# Altium schematic sheet IMSAI_SIO_Emulation.SchDoc: IMSAI SIO Emulation
size Tabloid; ApprovedBy: 1; CheckedBy: 1; Author: Codetector; CompanyName: Codetector; Engineer: 1; Organization: IMSAI Gang; Revision: 1; SheetNumber: 1; SheetTotal: 1; Application_BuildNumber: 1
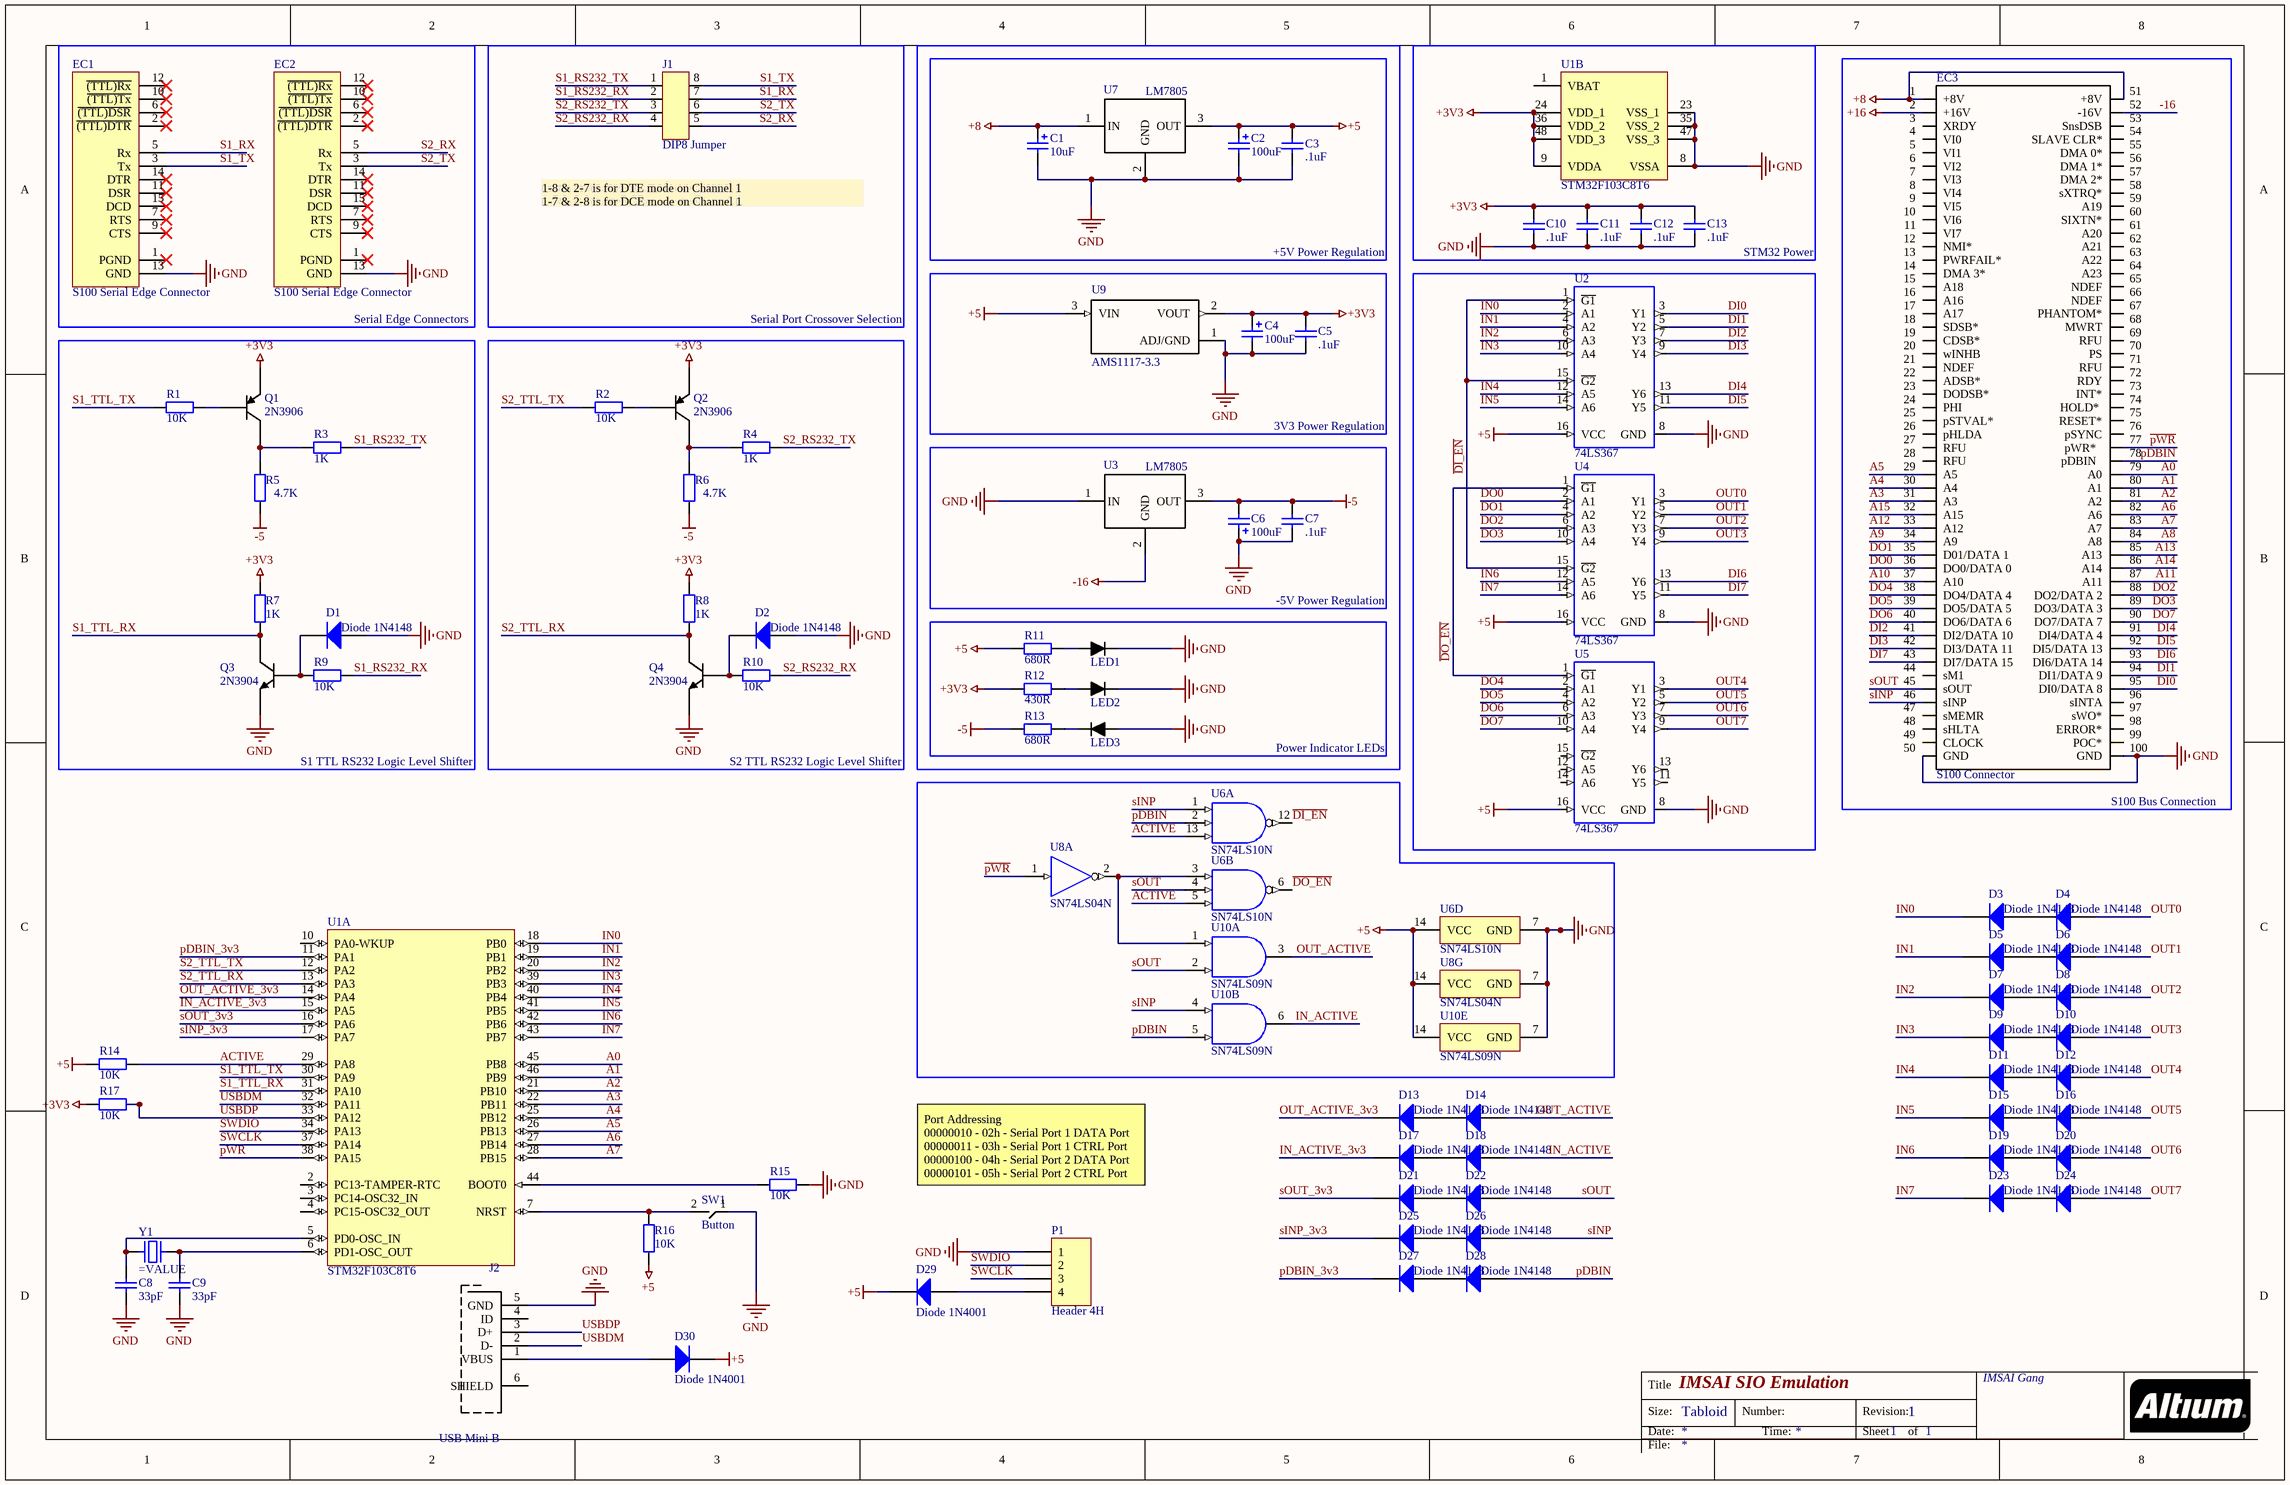
[diagram p0: IMSAI_SIO_Emulation.SchDoc]

## Parts
C1  value 10uF  [Cap THT 2.5-5-11]  (hidden comment: Capacitor 10uF)
C2  value 100uF  [CAP THT 2.5-6.5-12]  (hidden comment: Capacitor 100uF)
C3  value .1uF  [CAP THT 2.5x5x5]  (hidden comment: Capacitor .1uF)
C4  value 100uF  [CAP THT 2.5-6.5-12]  (hidden comment: Capacitor 100uF)
C5  value .1uF  [CAP THT 2.5x5x5]  (hidden comment: Capacitor .1uF)
C6  value 100uF  [CAP THT 2.5-6.5-12]  (hidden comment: Capacitor 100uF)
C7  value .1uF  [CAP THT 2.5x5x5]  (hidden comment: Capacitor .1uF)
C8  value 33pF  [Cap THT 2.5-2-4 Ceramic]  (hidden comment: Capacitor 33pF)
C9  value 33pF  [Cap THT 2.5-2-4 Ceramic]  (hidden comment: Capacitor 33pF)
C10  value .1uF  [CAP THT 2.5x5x5]  (hidden comment: Capacitor .1uF)
C11  value .1uF  [CAP THT 2.5x5x5]  (hidden comment: Capacitor .1uF)
C12  value .1uF  [CAP THT 2.5x5x5]  (hidden comment: Capacitor .1uF)
C13  value .1uF  [CAP THT 2.5x5x5]  (hidden comment: Capacitor .1uF)
D1  Diode 1N4148  [DO-35]
D2  Diode 1N4148  [DO-35]
D3  Diode 1N4148  [DO-35]
D4  Diode 1N4148  [DO-35]
D5  Diode 1N4148  [DO-35]
D6  Diode 1N4148  [DO-35]
D7  Diode 1N4148  [DO-35]
D8  Diode 1N4148  [DO-35]
D9  Diode 1N4148  [DO-35]
D10  Diode 1N4148  [DO-35]
D11  Diode 1N4148  [DO-35]
D12  Diode 1N4148  [DO-35]
D13  Diode 1N4148  [DO-35]
D14  Diode 1N4148  [DO-35]
D15  Diode 1N4148  [DO-35]
D16  Diode 1N4148  [DO-35]
D17  Diode 1N4148  [DO-35]
D18  Diode 1N4148  [DO-35]
D19  Diode 1N4148  [DO-35]
D20  Diode 1N4148  [DO-35]
D21  Diode 1N4148  [DO-35]
D22  Diode 1N4148  [DO-35]
D23  Diode 1N4148  [DO-35]
D24  Diode 1N4148  [DO-35]
D25  Diode 1N4148  [DO-35]
D26  Diode 1N4148  [DO-35]
D27  Diode 1N4148  [DO-35]
D28  Diode 1N4148  [DO-35]
D29  Diode 1N4001  [DO-41]
D30  Diode 1N4001  [DO-41]
EC1  S100 Serial Edge Connector  [E26 Edge Connector]
EC2  S100 Serial Edge Connector  [E26 Edge Connector]
EC3  S100 Connector  [S100]
J1  DIP8 Jumper  [DIP8]
J2  USB Mini B  [USB Mini B]
LED1  Generic LED 5mm  [LED 5mm THT]  (value not drawn)
LED2  Generic LED 5mm  [LED 5mm THT]  (value not drawn)
LED3  Generic LED 5mm  [LED 5mm THT]  (value not drawn)
P1  Header 4H  [HDR1X4H]
Q1  2N3906  [TO-92A]
Q2  2N3906  [TO-92A]
Q3  2N3904  [TO-92A]
Q4  2N3904  [TO-92A]
R1  Res2  [AXIAL-0.4]  (value not drawn)
R2  Res2  [AXIAL-0.4]  (value not drawn)
R3  Res2  [AXIAL-0.4]  (value not drawn)
R4  Res2  [AXIAL-0.4]  (value not drawn)
R5  Res2  [AXIAL-0.4]  (value not drawn)
R6  Res2  [AXIAL-0.4]  (value not drawn)
R7  Res2  [AXIAL-0.4]  (value not drawn)
R8  Res2  [AXIAL-0.4]  (value not drawn)
R9  Res2  [AXIAL-0.4]  (value not drawn)
R10  Res2  [AXIAL-0.4]  (value not drawn)
R11  Res2  [AXIAL-0.4]  (value not drawn)
R12  Res2  [AXIAL-0.4]  (value not drawn)
R13  Res2  [AXIAL-0.4]  (value not drawn)
R14  Res2  [AXIAL-0.4]  (value not drawn)
R15  Res2  [AXIAL-0.4]  (value not drawn)
R16  Res2  [AXIAL-0.4]  (value not drawn)
R17  Res2  [AXIAL-0.4]  (value not drawn)
SW1  Button  [SMD_PUSHBUTTON_LCSC]
U1  STM32F103C8T6  [STM-LQFP48_L]  (parts A,B of 2)
U2  74LS367  [DIP16]
U3  LM7805  [TO220]
U4  74LS367  [DIP16]
U5  74LS367  [DIP16]
U6  SN74LS10N  [N0014A]  (parts A,B,D of 4)
U7  LM7805  [TO220]
U8  SN74LS04N  [N0014A]  (parts A,G of 7)
U9  AMS1117-3.3  [TO220]
U10  SN74LS09N  [N0014A]  (parts A,B,E of 5)
Y1  (no value)  [ABRACON ABLS]

## Blocks framed on the sheet
Serial Edge Connectors: EC1 EC2
Power Indicator LEDs: C1-C3 U7
S100 Bus Connection: EC3
+5V Power Regulation: C4 C5 U9
STM32 Power: U2 U4 U5
S1 TTL RS232 Logic Level Shifter: D1 Q1 Q3 R1 R3 R5 R7 R9
3V3 Power Regulation: C6 C7 U3
-5V Power Regulation: LED1-LED3 R11-R13

## Nets
+3V3: C4.1 C5.2 C10.2 C11.2 C12.2 C13.2 Q1.1(E) Q2.1(E) R7.1 R8.1 R12.2 R17.2 U1.9(VDDA) U1.24(VDD_1) U1.36(VDD_2) U1.48(VDD_3) U9.2(VOUT)
+5: C2.1 C3.2 D29.2(K) D30.2(K) R11.2 R14.2 R16.2 U2.16(VCC) U4.16(VCC) U5.16(VCC) U6.14(VCC) U7.3(OUT) U8.14(VCC) U9.3(VIN) U10.14(VCC)
+8: C1.1 EC3.1(+8V) EC3.51(+8V) U7.1(IN)
+16: EC3.2(+16V)
-5: C6.2 C7.1 R5.1 R6.1 R13.2 U3.3(OUT)
-16: EC3.52(-16V) U3.2(GND)
GND: C1.2 C2.2 C3.1 C4.2 C5.1 C6.1 C7.2 C8.1 C9.1 C10.1 C11.1 C12.1 C13.1 D1.1(A) D2.1(A) EC1.13(GND) EC2.13(GND) EC3.50(GND) EC3.100(GND) J2.5(GND) LED1.2(K) LED2.2(K) LED3.1(A) P1.1 Q3.1(E) Q4.1(E) R15.1 SW1.1 U1.8(VSSA) U1.23(VSS_1) U1.35(VSS_2) U1.47(VSS_3) U2.8(GND) U3.1(IN) U4.8(GND) U5.8(GND) U6.7(GND) U7.2(GND) U8.7(GND) U9.1(ADJ/GND) U10.7(GND)
~{DI_EN}: U2.1(~{G1}) U2.15(~{G2}) U4.15(~{G2}) U6.12(1Y)
~{DO_EN}: U4.1(~{G1}) U5.1(~{G1}) U6.6(2Y)
~{pWR}: EC3.77(pWR*) U1.38(PA15) U8.1(1A)
A0: EC3.79(A0) U1.45(PB8)
A1: EC3.80(A1) U1.46(PB9)
A2: EC3.81(A2) U1.21(PB10)
A3: EC3.31(A3) U1.22(PB11)
A4: EC3.30(A4) U1.25(PB12)
A5: EC3.29(A5) U1.26(PB13)
A6: EC3.82(A6) U1.27(PB14)
A7: EC3.83(A7) U1.28(PB15)
A8: EC3.84(A8)
A9: EC3.34(A9)
A10: EC3.37(A10)
A11: EC3.87(A11)
A12: EC3.33(A12)
A13: EC3.85(A13)
A14: EC3.86(A14)
A15: EC3.32(A15)
ACTIVE: R14.1 U1.29(PA8) U6.5(2C) U6.13(1C)
DI0: EC3.95(DI0/DATA_8) U2.3(Y1)
DI1: EC3.94(DI1/DATA_9) U2.5(Y2)
DI2: EC3.41(DI2/DATA_10) U2.7(Y3)
DI3: EC3.42(DI3/DATA_11) U2.9(Y4)
DI4: EC3.91(DI4/DATA_4) U2.13(Y6)
DI5: EC3.92(DI5/DATA_13) U2.11(Y5)
DI6: EC3.93(DI6/DATA_14) U4.13(Y6)
DI7: EC3.43(DI7/DATA_15) U4.11(Y5)
DO0: EC3.36(DO0/DATA_0) U4.2(A1)
DO1: EC3.35(D01/DATA_1) U4.4(A2)
DO2: EC3.88(DO2/DATA_2) U4.6(A3)
DO3: EC3.89(DO3/DATA_3) U4.10(A4)
DO4: EC3.38(DO4/DATA_4) U5.2(A1)
DO5: EC3.39(DO5/DATA_5) U5.4(A2)
DO6: EC3.40(DO6/DATA_6) U5.6(A3)
DO7: EC3.90(DO7/DATA_7) U5.10(A4)
IN0: D3.2(K) U1.18(PB0) U2.2(A1)
IN1: D5.2(K) U1.19(PB1) U2.4(A2)
IN2: D7.2(K) U1.20(PB2) U2.6(A3)
IN3: D9.2(K) U1.39(PB3) U2.10(A4)
IN4: D11.2(K) U1.40(PB4) U2.12(A5)
IN5: D15.2(K) U1.41(PB5) U2.14(A6)
IN6: D19.2(K) U1.42(PB6) U4.12(A5)
IN7: D23.2(K) U1.43(PB7) U4.14(A6)
IN_ACTIVE: D18.1(A) U10.6(2Y)
IN_ACTIVE_3v3: D17.2(K) U1.15(PA5)
OUT0: D4.1(A) U4.3(Y1)
OUT1: D6.1(A) U4.5(Y2)
OUT2: D8.1(A) U4.7(Y3)
OUT3: D10.1(A) U4.9(Y4)
OUT4: D12.1(A) U5.3(Y1)
OUT5: D16.1(A) U5.5(Y2)
OUT6: D20.1(A) U5.7(Y3)
OUT7: D24.1(A) U5.9(Y4)
OUT_ACTIVE: D14.1(A) U10.3(1Y)
OUT_ACTIVE_3v3: D13.2(K) U1.14(PA4)
pDBIN: D28.1(A) EC3.78(pDBIN) U6.2(1B) U10.5(2B)
pDBIN_3v3: D27.2(K) U1.11(PA1)
S1_RS232_RX: J1.2 R9.1
S1_RS232_TX: J1.1 R3.1
S1_RX: EC1.5(Rx) J1.7
S1_TTL_RX: Q3.3(C) R7.2 U1.31(PA10)
S1_TTL_TX: R1.2 U1.30(PA9)
S1_TX: EC1.3(Tx) J1.8
S2_RS232_RX: J1.4 R10.1
S2_RS232_TX: J1.3 R4.1
S2_RX: EC2.5(Rx) J1.5
S2_TTL_RX: Q4.3(C) R8.2 U1.13(PA3)
S2_TTL_TX: R2.2 U1.12(PA2)
S2_TX: EC2.3(Tx) J1.6
sINP: D26.1(A) EC3.46(sINP) U6.1(1A) U10.4(2A)
sINP_3v3: D25.2(K) U1.17(PA7)
sOUT: D22.1(A) EC3.45(sOUT) U6.4(2B) U10.2(1B)
sOUT_3v3: D21.2(K) U1.16(PA6)
SWCLK: P1.3 U1.37(PA14)
SWDIO: P1.2 U1.34(PA13)
USBDM: J2.2(D-) U1.32(PA11)
USBDP: J2.3(D+) R17.1 U1.33(PA12)
NetC8_2: C8.2 U1.5(PD0-OSC_IN) Y1.2
NetC9_2: C9.2 U1.6(PD1-OSC_OUT) Y1.1
NetD1_2: D1.2(K) Q3.2(B) R9.2
NetD2_2: D2.2(K) Q4.2(B) R10.2
NetD3_1: D3.1(A) D4.2(K)
NetD5_1: D5.1(A) D6.2(K)
NetD7_1: D7.1(A) D8.2(K)
NetD9_1: D9.1(A) D10.2(K)
NetD11_1: D11.1(A) D12.2(K)
NetD13_1: D13.1(A) D14.2(K)
NetD15_1: D15.1(A) D16.2(K)
NetD17_1: D17.1(A) D18.2(K)
NetD19_1: D19.1(A) D20.2(K)
NetD21_1: D21.1(A) D22.2(K)
NetD23_1: D23.1(A) D24.2(K)
NetD25_1: D25.1(A) D26.2(K)
NetD27_1: D27.1(A) D28.2(K)
NetD29_1: D29.1(A) P1.4
NetD30_1: D30.1(A) J2.1(VBUS)
NetLED1_1: LED1.1(A) R11.1
NetLED2_1: LED2.1(A) R12.1
NetLED3_2: LED3.2(K) R13.1
NetQ1_2: Q1.2(B) R1.1
NetQ1_3: Q1.3(C) R3.2 R5.2
NetQ2_2: Q2.2(B) R2.1
NetQ2_3: Q2.3(C) R4.2 R6.2
NetR15_2: R15.2 U1.44(BOOT0)
NetR16_1: R16.1 SW1.2 U1.7(NRST)
NetU6_3: U6.3(2A) U8.2(~{1Y}) U10.1(1A)

Not connected (* = marked no-connect by the designer): EC1 1(PGND)* 2(~{(TTL)DTR})* 6(~{(TTL)DSR})* 7(RTS)* 9(CTS)* 10(~{(TTL)Tx})* 11(DSR)* 12(~{(TTL)Rx})* 14(DTR)* 15(DCD)*; EC2 1(PGND)* 2(~{(TTL)DTR})* 6(~{(TTL)DSR})* 7(RTS)* 9(CTS)* 10(~{(TTL)Tx})* 11(DSR)* 12(~{(TTL)Rx})* 14(DTR)* 15(DCD)*; EC3 3(XRDY) 4(VI0) 5(VI1) 6(VI2) 7(VI3) 8(VI4) 9(VI5) 10(VI6) 11(VI7) 12(NMI*) 13(PWRFAIL*) 14(DMA_3*) 15(A18 ) 16(A16  ) 17(A17) 18(SDSB*) 19(CDSB*) 20(wINHB) 21(NDEF) 22(ADSB*) 23(DODSB*) 24(PHI) 25(pSTVAL*) 26(pHLDA) 27(RFU) 28(RFU) 44(sM1) 47(sMEMR) 48(sHLTA) 49(CLOCK ) 53(SnsDSB) 54(SLAVE_CLR*) 55(DMA_0*) 56(DMA_1*) 57(DMA_2*) 58(sXTRQ*) 59(A19) 60(SIXTN*) 61(A20) 62(A21) 63(A22) 64(A23) 65(NDEF) 66(NDEF) 67(PHANTOM*) 68(MWRT) 69(RFU) 70(PS) 71(RFU) 72(RDY) 73(INT*) 74(HOLD* ) 75(RESET*) 76(pSYNC) 96(sINTA) 97(sWO*) 98(ERROR*) 99(POC*); J2 4(ID) 6(SHIELD); U1 1(VBAT) 2(PC13-TAMPER-RTC) 3(PC14-OSC32_IN) 4(PC15-OSC32_OUT) 10(PA0-WKUP); U5 11(Y5) 12(A5) 13(Y6) 14(A6) 15(~{G2})

## Notes on the sheet
- 1-8 & 2-7 is for DTE mode on Channel 1
  1-7 & 2-8 is for DCE mode on Channel 1
- Serial Port Crossover Selection
- S2 TTL RS232 Logic Level Shifter
- Port Addressing
  00000010 - 02h - Serial Port 1 DATA Port
  00000011 - 03h - Serial Port 1 CTRL Port
  00000100 - 04h - Serial Port 2 DATA Port
  00000101 - 05h - Serial Port 2 CTRL Port
- Title
- Size:
- Date:
- Tabloid
- Number:
- Time:
- Revision:
- Sheet
- of
- File:
- (in symbol Res2) 4.7K; 10K; 1K; 680R; 430R

## Library data of the parts
D1-D28 = Diode 1N4148: High Conductance Fast Diode; Published: 8-Jun-2000; LatestRevisionDate: 17-Jul-2002; LatestRevisionNote: Re-released for DXP Platform.; DatasheetVersion: 1997; PackageReference: DO-35; Publisher: Altium Limited; PackageDescription: Diode, Axial; Body 3.8 x 1.9 mm (LxDia. max), Lead Dia. 0.53 mm (max); Code_JEDEC: DO-204-AH; ComponentLink1Description: Manufacturer Link; ComponentLink1URL: http://www.fairchildsemi.com/; ComponentLink2Description: Datasheet; ComponentLink2URL: http://www.fairchildsemi.com/ds/1N%2F1N4148.pdf
D29 D30 = Diode 1N4001: 1 Amp General Purpose Rectifier; Published: 8-Jun-2000; LatestRevisionDate: 17-Jul-2002; LatestRevisionNote: Re-released for DXP Platform.; DatasheetVersion: 1998; PackageVersion: Aug-1999; PackageReference: DO-41; Publisher: Altium Limited; PackageDescription: Diode, Axial; Body 5.2 x 2.7 mm (LxDia. max), Lead Dia. 0.86 mm (max); Code_JEDEC: DO-204-AL; ComponentLink1Description: Manufacturer Link; ComponentLink1URL: http://www.fairchildsemi.com/; ComponentLink2Description: Datasheet; ComponentLink2URL: http://www.fairchildsemi.com/ds/1N%2F1N4001.pdf
J2 = USB Mini B: MINI USB A - 5POS Horizontal through hole; MF: Wurth Electronics; MP: 651005136521; Package: None; Price: 1.78 USD; Availability: Good; SnapEDA_Link: https://www.snapeda.com/symbols-footprints/651005136521/Wurth%20Electronics%20Inc/view-part/?ref=snap; Value: *
P1 = Header 4H: Header, 4-Pin, Right Angle; LatestRevisionDate: 17-Jul-2002; LatestRevisionNote: Re-released for DXP Platform.; Publisher: Altium Limited
Q1 Q2 = 2N3906: 2N3906 GP PNP; Published: 8-Jun-2000; LatestRevisionDate: 15-Jan-2003; LatestRevisionNote: PCB Footprint 'BCY-W3/D4.7' replaced; DatasheetVersion: 1997; PackageVersion: Sep-1998; PackageReference: TO-92A; Publisher: Altium Limited; PackageDescription: TO, Flat Index; 3 In-Line, Axial Leads; Body Dia. 4.5mm; Leads 0.51 x 0.48 mm (max); ComponentLink1Description: Manufacturer Link; ComponentLink1URL: http://www.fairchildsemi.com/; ComponentLink2Description: Datasheet; ComponentLink2URL: http://www.fairchildsemi.com/ds/2N%2F2N3906.pdf
Q3 Q4 = 2N3904: NPN General Purpose Amplifier; Published: 8-Jun-2000; LatestRevisionDate: 15-Jan-2003; LatestRevisionNote: PCB Footprint 'BCY-W3/D4.7' replaced; DatasheetVersion: 1997; PackageVersion: Sep-1998; PackageReference: TO-92A; Publisher: Altium Limited; PackageDescription: TO, Flat Index; 3 In-Line, Axial Leads; Body Dia. 4.5mm; Leads 0.51 x 0.48 mm (max); ComponentLink1Description: Manufacturer Link; ComponentLink1URL: http://www.fairchildsemi.com/; ComponentLink2Description: Datasheet; ComponentLink2URL: http://www.fairchildsemi.com/ds/2N%2F2N3904.pdf
R1-R17 = Res2: Resistor; Published: 8-Jun-2000; LatestRevisionDate: 17-Jul-2002; LatestRevisionNote: Re-released for DXP Platform.; PackageReference: AXIAL-0.4; Publisher: Altium Limited; PackageDescription: Axial Device, Thru-Hole; 2 Leads; 0.4 in Pin Spacing
SW1 = Button: LCSC Push button SMD
U1 = STM32F103C8T6: ARM Cortex-M3 32-bit MCU, 64 KB Flash, 20 KB Internal RAM, 37 I/Os, 48-pin LQFP, -40 to 85 degC, Tray; A/D Converter: 2x12-bit (10 Channel); FLASH Size (Prog) (kB): 64; I/Os (High Current): 37; Internal RAM Size (kB): 20; Operating Frequency(F) (Processor speed) (MHz): 72; Supply Voltage(Vcc) min (V): 2; DatasheetVersion: Rev. 16; PackageVersion: Rev. 6, 06/2013; PackageReference: LQFP48; PackageDescription: 48-Pin Low Profile Quad Flat Package, 7 x 7 mm Body, 0.5 mm Pitch; Supplier 1: Digi-Key; Supplier Part Number 1: 497-6063-ND; Supplier 2: Farnell; Supplier Part Number 2: 1447637; Supplier 3: Newark; Supplier Part Number 3: 59M2182; Supplier 4: Newark; Supplier Part Number 4: 57P1222; Supplier 5: Mouser; Supplier Part Number 5: 511-STM32F103C8T6; Core: ARM Cortex-M3; Packing: Tray; Mounting Technology: Surface Mount; PartNumber: STM32F103C8T6; ComponentLink1Description: Manufacturer URL; ComponentLink1URL: http://www.st.com/web/en/home.html; ComponentLink2Description: Datasheet; ComponentLink2URL: http://www.st.com/st-web-ui/static/active/en/resource/technical/document/datasheet/CD00161566.pdf; ComponentLink3Description: Package Specification; ComponentLink3URL: http://www.st.com/st-web-ui/static/active/en/resource/technical/document/datasheet/DM00058181.pdf
U3 U7 = LM7805: LM7805 Linear Voltage Regulator
U6 = SN74LS10N: Triple 3-input positive-NAND gates, N0014A, TUBE; Manufacturer: Texas Instruments; VCC(Min)(V): 4.75; VCC(Max)(V): 5.25; Output Type: TTL; ICC @ Nom Voltage(Max)(mA): 0.027; Bits(#): 3; F @ Nom Voltage(Max)(Mhz): 35; Rating: Catalog; Technology Family: LS; Voltage(Nom)(V): 5; Schmitt Trigger: No; Output Drive (IOL/IOH)(Max)(mA): 1/-20; DatasheetVersion: SDLS035A; PackageReference: N0014A; Supplier 1: Mouser; Supplier Part Number 1: 595-SN74LS10N; Supplier 2: Digi-Key; Supplier Part Number 2: 296-1634-5-ND; Generic Part Number: SN74LS10; Input Type: TTL; Operating Temperature Range(C): 0 to 70; tpd @ Nom Voltage(Max)(ns): 5; Code_JEDEC: MS-001; PartNumber: SN74LS10N; ComponentLink1Description: Manufacturer URL; ComponentLink1URL: http://www.ti.com/; ComponentLink2Description: Datasheet; ComponentLink2URL: http://www.ti.com/lit/ds/symlink/sn74ls10.pdf; ComponentLink3Description: Package Specification; ComponentLink3URL: http://www.ti.com/lit/ml/mpdi002c/mpdi002c.pdf
U8 = SN74LS04N: Hex inverters, N0014A, TUBE; Manufacturer: Texas Instruments; VCC(Min)(V): 4.75; VCC(Max)(V): 5.25; Output Type: CMOS; ICC @ Nom Voltage(Max)(mA): 0.033; Input Type: TTL; Bits(#): 6; F @ Nom Voltage(Max)(Mhz): 35; Rating: Catalog; Technology Family: LS; Voltage(Nom)(V): 5; Schmitt Trigger: No; Output Drive (IOL/IOH)(Max)(mA): -0.4/8; tpd @ Nom Voltage(Max)(ns): 22; DatasheetVersion: SDLS029C; PackageReference: N0014A; Generic Part Number: SN74LS04; Operating Temperature Range(C): 0 to 70; PartNumber: SN74LS04N; ComponentLink1Description: Manufacturer URL; ComponentLink1URL: http://www.ti.com/; ComponentLink2Description: Datasheet; ComponentLink2URL: http://www.ti.com/lit/ds/symlink/sn74ls04.pdf; ComponentLink3Description: Package Specification; ComponentLink3URL: http://www.ti.com/lit/ml/mpdi002c/mpdi002c.pdf
U9 = AMS1117-3.3: 1-Amp 3.3-Volt Low Drop Out Voltage Regulatator; MF: Advanced Monolithic Systems; SnapEDA_Link: https://www.snapeda.com/parts/AMS1117-3.3/Advanced%20Monolithic%20Systems/view-part/?ref=snap; Price: None; MP: AMS1117-3.3; Availability: Unavailable; Package: None; Value: *
U10 = SN74LS09N: Quad 2-input positive-AND gates with open collector outputs, N0014A, TUBE; Manufacturer: Texas Instruments; VCC(Min)(V): 4.75; VCC(Max)(V): 5.25; Output Type: TTL; ICC @ Nom Voltage(Max)(mA): 0.0048; Bits(#): 4; F @ Nom Voltage(Max)(Mhz): 35; Rating: Catalog; Technology Family: LS; Voltage(Nom)(V): 5; Schmitt Trigger: No; Output Drive (IOL/IOH)(Max)(mA): -0.8/16; DatasheetVersion: SDLS034; PackageReference: N0014A; Supplier 1: Mouser; Supplier Part Number 1: 595-SN74LS09N; Supplier 2: Digi-Key; Supplier Part Number 2: 296-3631-5-ND; Generic Part Number: SN74LS09; Input Type: TTL; Operating Temperature Range(C): 0 to 70; tpd @ Nom Voltage(Max)(ns): 35; PartNumber: SN74LS09N; ComponentLink1Description: Manufacturer URL; ComponentLink1URL: http://www.ti.com/; ComponentLink2Description: Datasheet; ComponentLink2URL: http://www.ti.com/lit/ds/symlink/sn74ls09.pdf
Y1 = Abracon Crystal ABLS: SMT Crystal
C1 = Capacitor 10uF: Published: 8-Jun-2000; LatestRevisionDate: 17-Jul-2002; LatestRevisionNote: Re-released for DXP Platform.; PackageReference: RB7.6-15; Publisher: Altium Limited; PackageDescription: Polarized Capacitor (Radial); 2 Leads
C2 C4 C6 = Capacitor 100uF: Published: 8-Jun-2000; LatestRevisionDate: 17-Jul-2002; LatestRevisionNote: Re-released for DXP Platform.; PackageReference: RB7.6-15; Publisher: Altium Limited; PackageDescription: Polarized Capacitor (Radial); 2 Leads
C3 C5 C7 C10-C13 = Capacitor .1uF: Published: 8-Jun-2000; LatestRevisionDate: 17-Jul-2002; LatestRevisionNote: Re-released for DXP Platform.; PackageReference: RB7.6-15; Publisher: Altium Limited; PackageDescription: Polarized Capacitor (Radial); 2 Leads
C8 C9 = Capacitor 33pF: Published: 8-Jun-2000; LatestRevisionDate: 17-Jul-2002; LatestRevisionNote: Re-released for DXP Platform.; PackageReference: RB7.6-15; Publisher: Altium Limited; PackageDescription: Polarized Capacitor (Radial); 2 Leads